# EAGLE design led_jetracer_matrix (EAGLE 9.6.2)

## Sheet 1 of 2
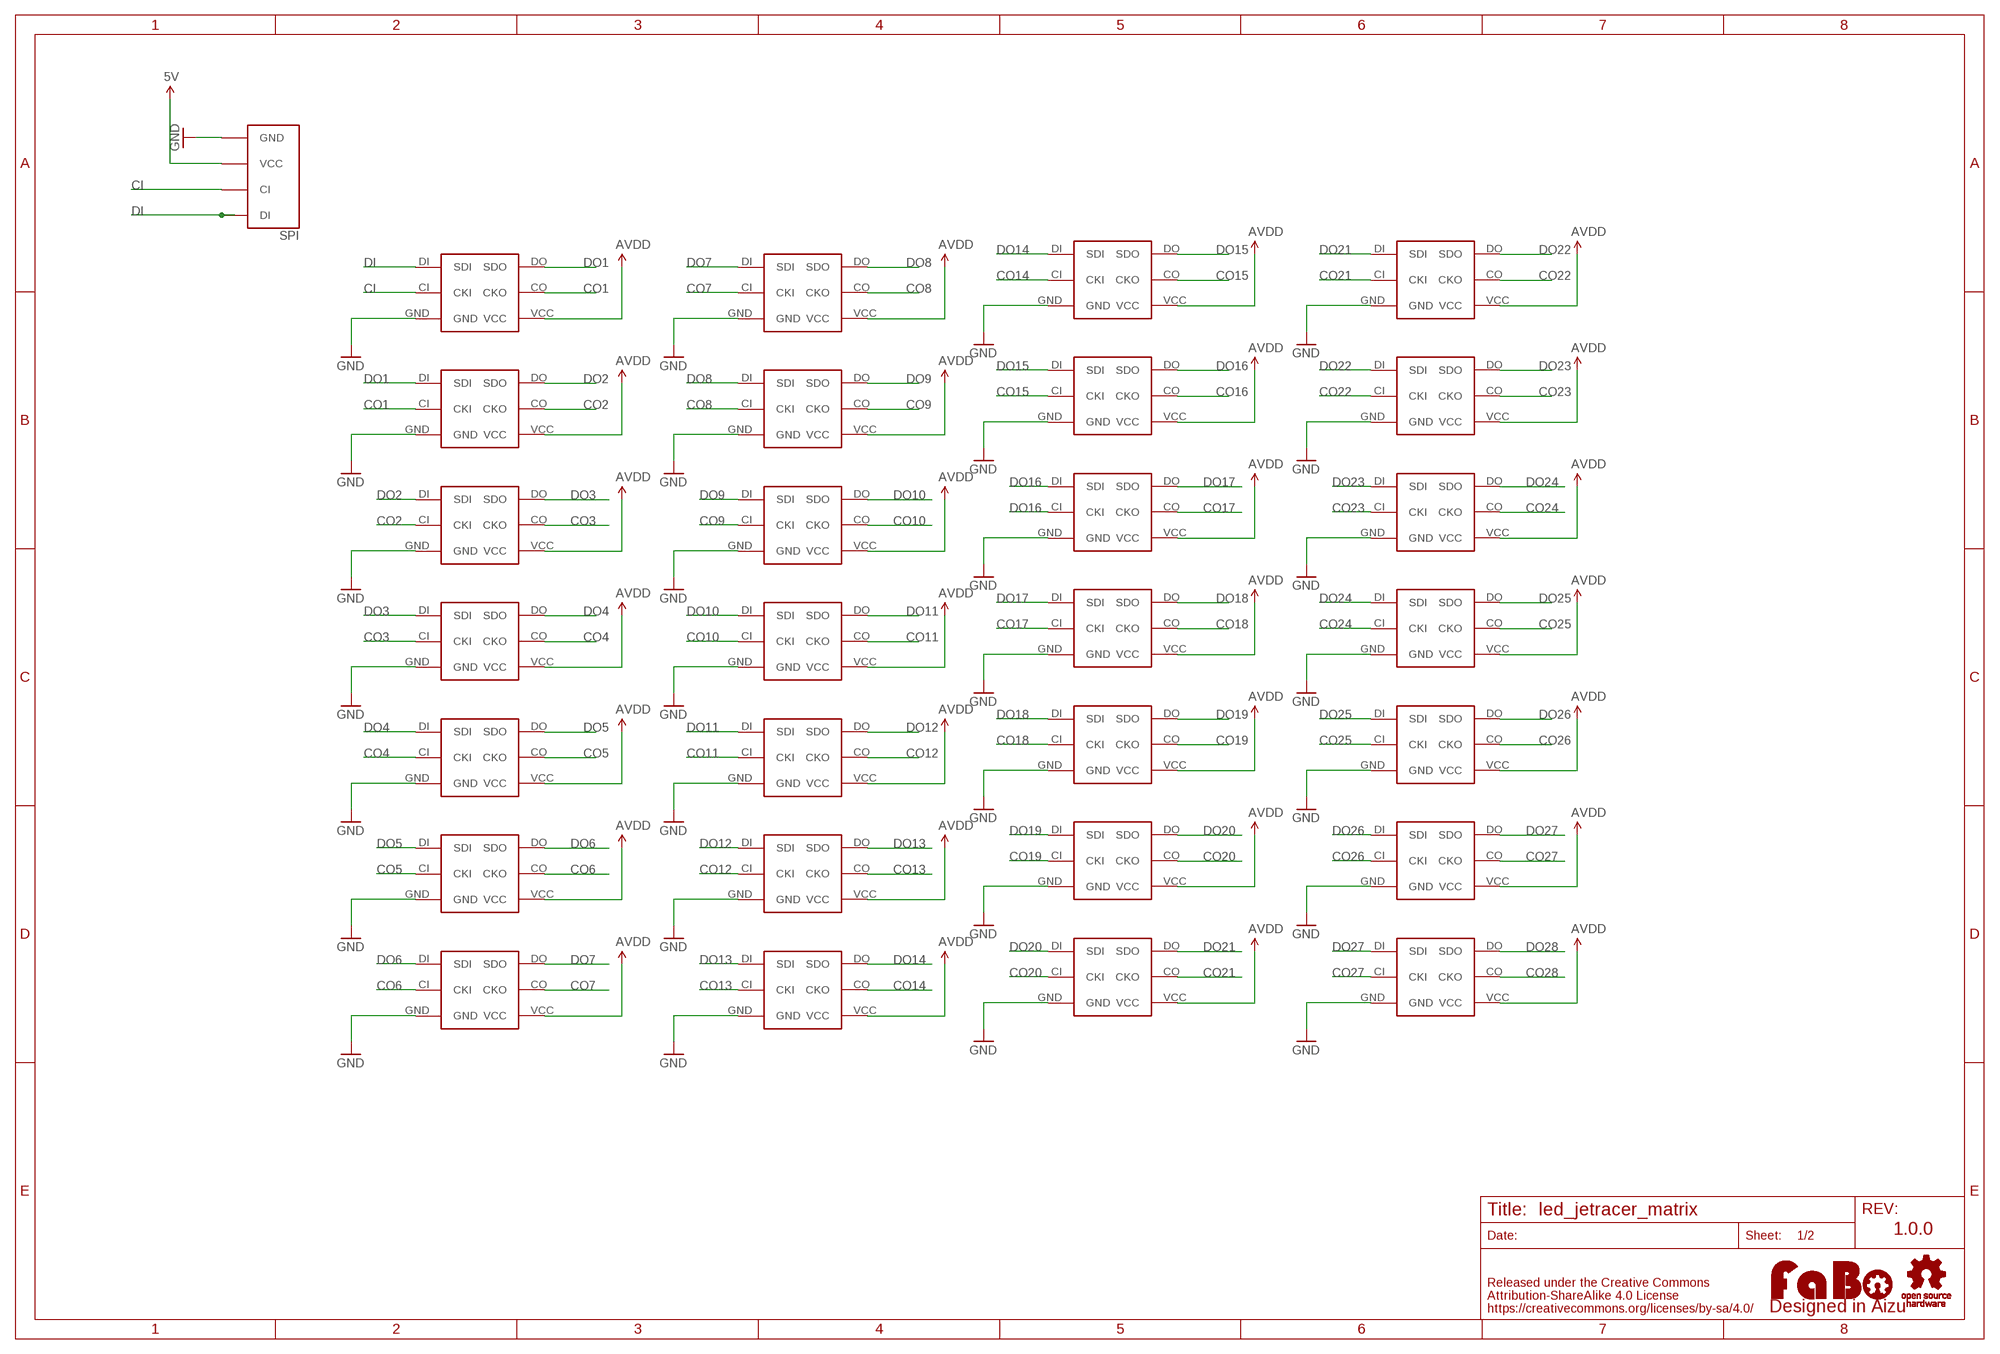
[diagram p0: schematic, sheet 1]

### Parts
0  APA102_IPIXEL  [APA102(IPIXEL)]
1  APA102_IPIXEL  [APA102(IPIXEL)]
2  APA102_IPIXEL  [APA102(IPIXEL)]
3  APA102_IPIXEL  [APA102(IPIXEL)]
4  APA102_IPIXEL  [APA102(IPIXEL)]
5  APA102_IPIXEL  [APA102(IPIXEL)]
6  APA102_IPIXEL  [APA102(IPIXEL)]
7  APA102_IPIXEL  [APA102(IPIXEL)]
8  APA102_IPIXEL  [APA102(IPIXEL)]
9  APA102_IPIXEL  [APA102(IPIXEL)]
10  APA102_IPIXEL  [APA102(IPIXEL)]
11  APA102_IPIXEL  [APA102(IPIXEL)]
12  APA102_IPIXEL  [APA102(IPIXEL)]
13  APA102_IPIXEL  [APA102(IPIXEL)]
14  APA102_IPIXEL  [APA102(IPIXEL)]
15  APA102_IPIXEL  [APA102(IPIXEL)]
16  APA102_IPIXEL  [APA102(IPIXEL)]
17  APA102_IPIXEL  [APA102(IPIXEL)]
18  APA102_IPIXEL  [APA102(IPIXEL)]
19  APA102_IPIXEL  [APA102(IPIXEL)]
20  APA102_IPIXEL  [APA102(IPIXEL)]
21  APA102_IPIXEL  [APA102(IPIXEL)]
22  APA102_IPIXEL  [APA102(IPIXEL)]
23  APA102_IPIXEL  [APA102(IPIXEL)]
24  APA102_IPIXEL  [APA102(IPIXEL)]
25  APA102_IPIXEL  [APA102(IPIXEL)]
26  APA102_IPIXEL  [APA102(IPIXEL)]
27  APA102_IPIXEL  [APA102(IPIXEL)]
LOGO1  LOGO_FABO-M_BOTTOM  [LOGO_FABO_M_BOTTOM]
SPI  FABO-SPI-LED-B04B-BOTTOM  [SPI-B04-PASK-1-BOTTOM]
U$3  LOGO_OSHW-S_BOTTOM  [LOGO_OSHW_S_BOTTOM]

### Nets
5V: SPI.VCC
AVDD: 0.VCC 1.VCC 2.VCC 3.VCC 4.VCC 5.VCC 6.VCC 7.VCC 8.VCC 9.VCC 10.VCC 11.VCC 12.VCC 13.VCC 14.VCC 15.VCC 16.VCC 17.VCC 18.VCC 19.VCC 20.VCC 21.VCC 22.VCC 23.VCC 24.VCC 25.VCC 26.VCC 27.VCC ; also sheet 2
CI: 0.CI(CKI) SPI.CI
CO1: 0.CO(CKO) 1.CI(CKI)
CO2: 1.CO(CKO) 2.CI(CKI)
CO3: 2.CO(CKO) 3.CI(CKI)
CO4: 3.CO(CKO) 4.CI(CKI)
CO5: 4.CO(CKO) 5.CI(CKI)
CO6: 5.CO(CKO) 6.CI(CKI)
CO7: 6.CO(CKO) 7.CI(CKI)
CO8: 7.CO(CKO) 8.CI(CKI)
CO9: 8.CO(CKO) 9.CI(CKI)
CO10: 9.CO(CKO) 10.CI(CKI)
CO11: 10.CO(CKO) 11.CI(CKI)
CO12: 11.CO(CKO) 12.CI(CKI)
CO13: 12.CO(CKO) 13.CI(CKI)
CO14: 13.CO(CKO) 14.CI(CKI)
CO15: 14.CO(CKO) 15.CI(CKI)
CO16: 15.CO(CKO)
CO17: 16.CO(CKO) 17.CI(CKI)
CO18: 17.CO(CKO) 18.CI(CKI)
CO19: 18.CO(CKO) 19.CI(CKI)
CO20: 19.CO(CKO) 20.CI(CKI)
CO21: 20.CO(CKO) 21.CI(CKI)
CO22: 21.CO(CKO) 22.CI(CKI)
CO23: 22.CO(CKO) 23.CI(CKI)
CO24: 23.CO(CKO) 24.CI(CKI)
CO25: 24.CO(CKO) 25.CI(CKI)
CO26: 25.CO(CKO) 26.CI(CKI)
CO27: 26.CO(CKO) 27.CI(CKI)
CO28: 27.CO(CKO) ; also sheet 2
DI: 0.DI(SDI) SPI.DI
DO1: 0.DO(SDO) 1.DI(SDI)
DO2: 1.DO(SDO) 2.DI(SDI)
DO3: 2.DO(SDO) 3.DI(SDI)
DO4: 3.DO(SDO) 4.DI(SDI)
DO5: 4.DO(SDO) 5.DI(SDI)
DO6: 5.DO(SDO) 6.DI(SDI)
DO7: 6.DO(SDO) 7.DI(SDI)
DO8: 7.DO(SDO) 8.DI(SDI)
DO9: 8.DO(SDO) 9.DI(SDI)
DO10: 9.DO(SDO) 10.DI(SDI)
DO11: 10.DO(SDO) 11.DI(SDI)
DO12: 11.DO(SDO) 12.DI(SDI)
DO13: 12.DO(SDO) 13.DI(SDI)
DO14: 13.DO(SDO) 14.DI(SDI)
DO15: 14.DO(SDO) 15.DI(SDI)
DO16: 15.DO(SDO) 16.CI(CKI) 16.DI(SDI)
DO17: 16.DO(SDO) 17.DI(SDI)
DO18: 17.DO(SDO) 18.DI(SDI)
DO19: 18.DO(SDO) 19.DI(SDI)
DO20: 19.DO(SDO) 20.DI(SDI)
DO21: 20.DO(SDO) 21.DI(SDI)
DO22: 21.DO(SDO) 22.DI(SDI)
DO23: 22.DO(SDO) 23.DI(SDI)
DO24: 23.DO(SDO) 24.DI(SDI)
DO25: 24.DO(SDO) 25.DI(SDI)
DO26: 25.DO(SDO) 26.DI(SDI)
DO27: 26.DO(SDO) 27.DI(SDI)
DO28: 27.DO(SDO) ; also sheet 2
GND: 0.GND 1.GND 2.GND 3.GND 4.GND 5.GND 6.GND 7.GND 8.GND 9.GND 10.GND 11.GND 12.GND 13.GND 14.GND 15.GND 16.GND 17.GND 18.GND 19.GND 20.GND 21.GND 22.GND 23.GND 24.GND 25.GND 26.GND 27.GND SPI.GND ; also sheet 2

### Notes on the sheet
- 1.0.0

## Sheet 2 of 2
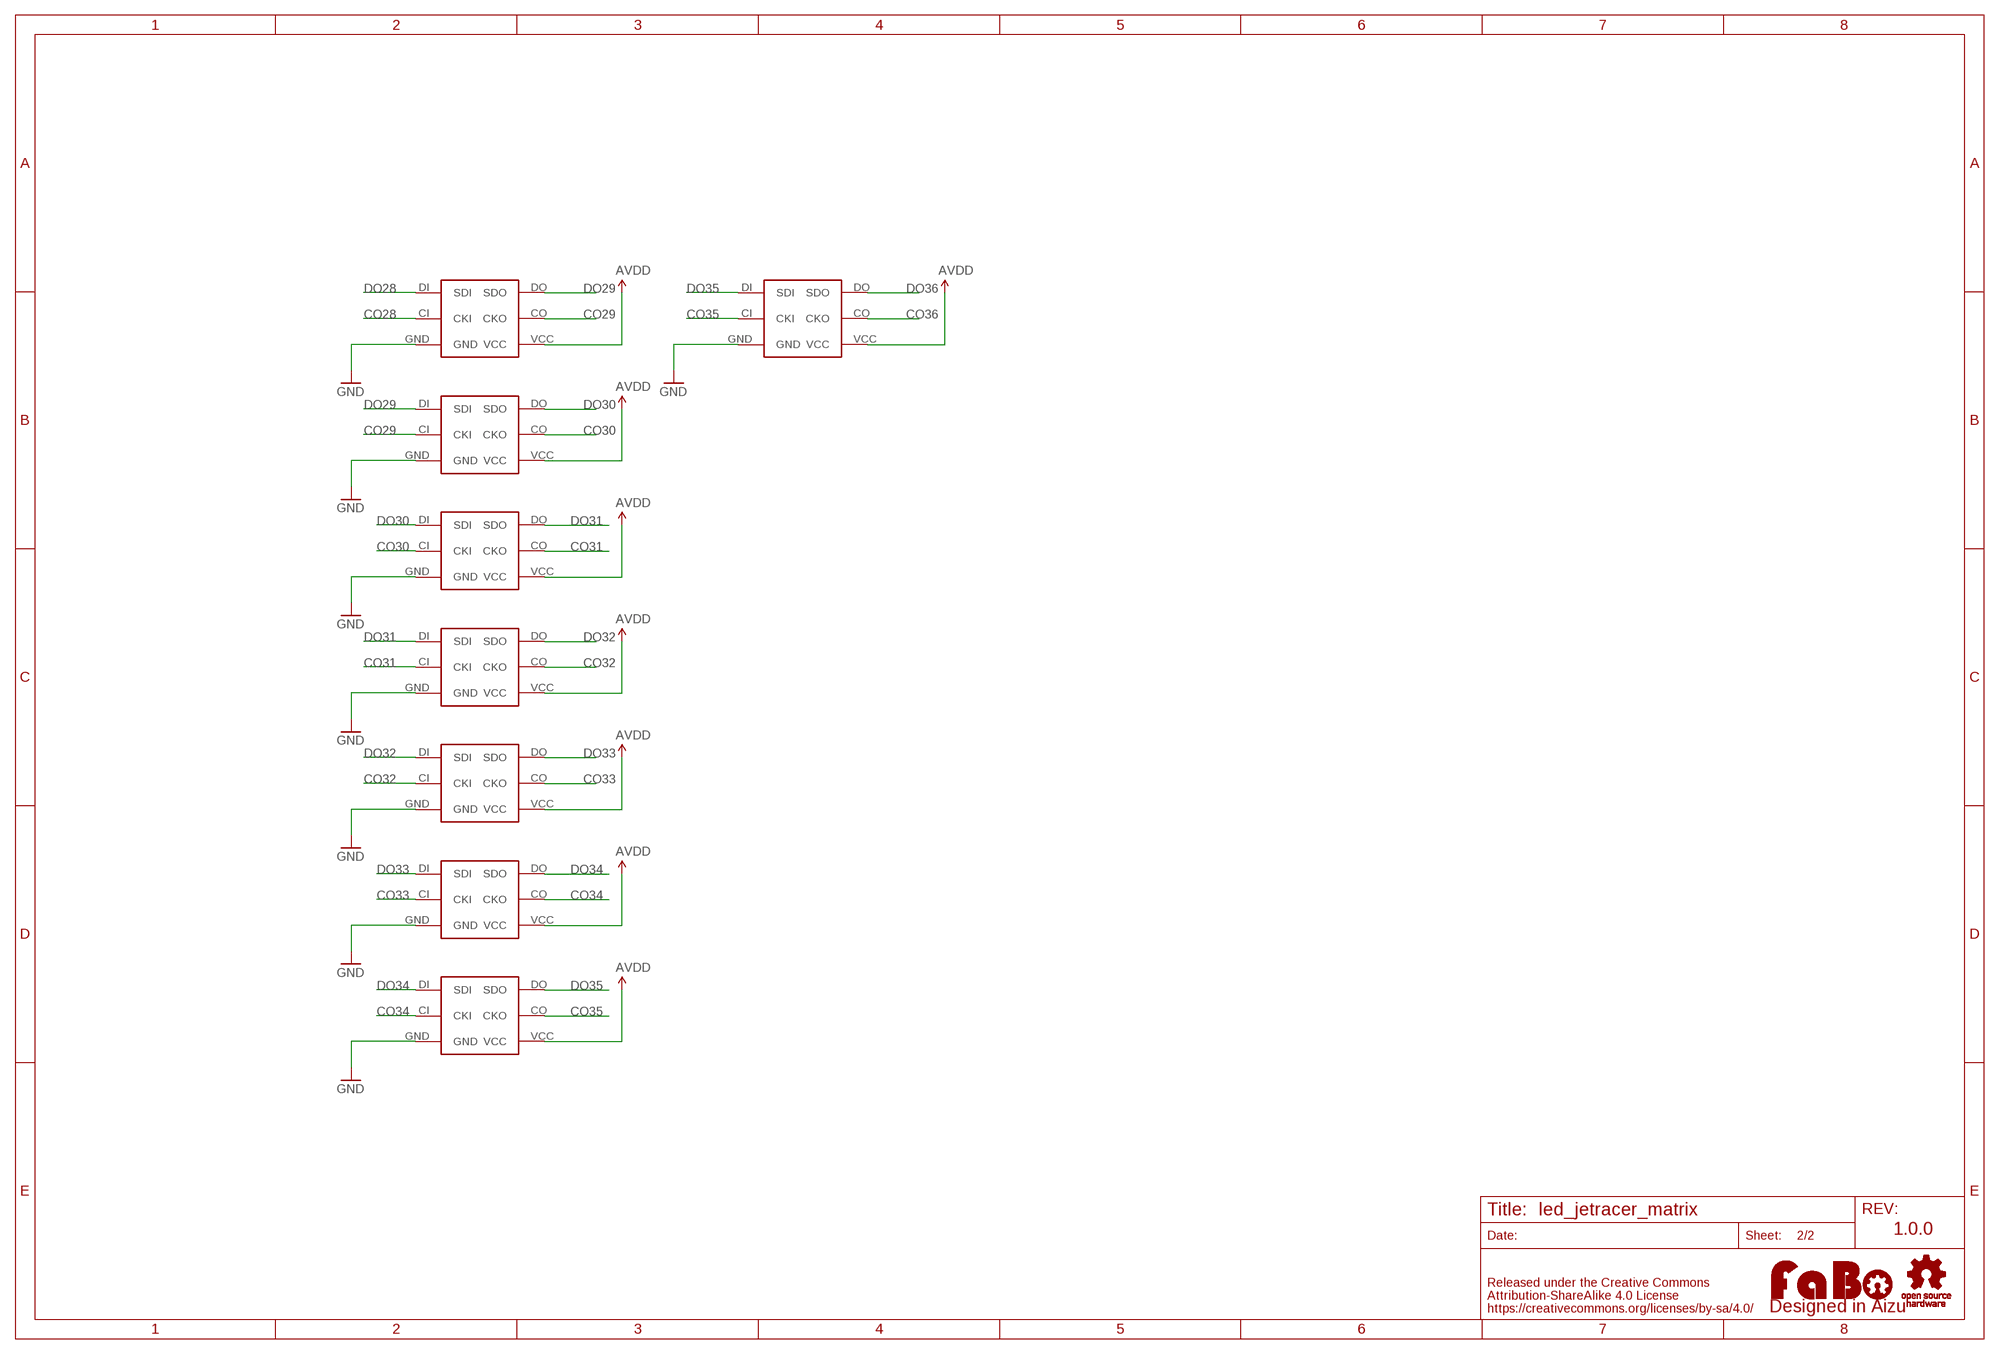
[diagram p1: schematic, sheet 2]

### Parts
28  APA102_IPIXEL  [APA102(IPIXEL)]
29  APA102_IPIXEL  [APA102(IPIXEL)]
30  APA102_IPIXEL  [APA102(IPIXEL)]
31  APA102_IPIXEL  [APA102(IPIXEL)]
32  APA102_IPIXEL  [APA102(IPIXEL)]
33  APA102_IPIXEL  [APA102(IPIXEL)]
34  APA102_IPIXEL  [APA102(IPIXEL)]
35  APA102_IPIXEL  [APA102(IPIXEL)]

### Nets
AVDD: 28.VCC 29.VCC 30.VCC 31.VCC 32.VCC 33.VCC 34.VCC 35.VCC ; also sheet 1
CO28: 28.CI(CKI) ; also sheet 1
CO29: 28.CO(CKO) 29.CI(CKI)
CO30: 29.CO(CKO) 30.CI(CKI)
CO31: 30.CO(CKO) 31.CI(CKI)
CO32: 31.CO(CKO) 32.CI(CKI)
CO33: 32.CO(CKO) 33.CI(CKI)
CO34: 33.CO(CKO) 34.CI(CKI)
CO35: 34.CO(CKO) 35.CI(CKI)
CO36: 35.CO(CKO)
DO28: 28.DI(SDI) ; also sheet 1
DO29: 28.DO(SDO) 29.DI(SDI)
DO30: 29.DO(SDO) 30.DI(SDI)
DO31: 30.DO(SDO) 31.DI(SDI)
DO32: 31.DO(SDO) 32.DI(SDI)
DO33: 32.DO(SDO) 33.DI(SDI)
DO34: 33.DO(SDO) 34.DI(SDI)
DO35: 34.DO(SDO) 35.DI(SDI)
DO36: 35.DO(SDO)
GND: 28.GND 29.GND 30.GND 31.GND 32.GND 33.GND 34.GND 35.GND ; also sheet 1

### Notes on the sheet
- 1.0.0

## Library data of the parts
0 1-35 = FaBo-LED:APA102
LOGO1 = component:LOGO_FABO
SPI = FaBo-Connetor:FABO-SPI-LED
U$3 = component:LOGO_OSHW

## Net classes
2 gnd: width 0.254 mm, drill 0.61 mm, clearance 0.254 mm
3 usbvcc: width 0.254 mm, drill 0.61 mm, clearance 0.254 mm
4 aref: width 0.254 mm, drill 0.61 mm, clearance 0.254 mm

## Board
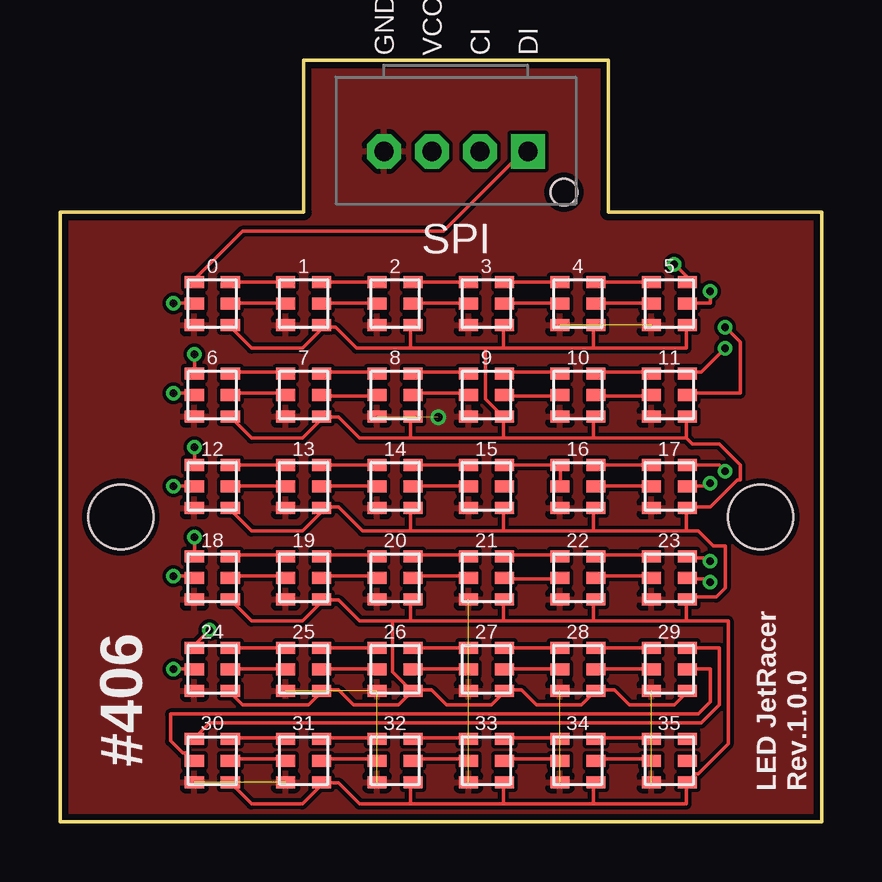
[diagram p2: board, top side]
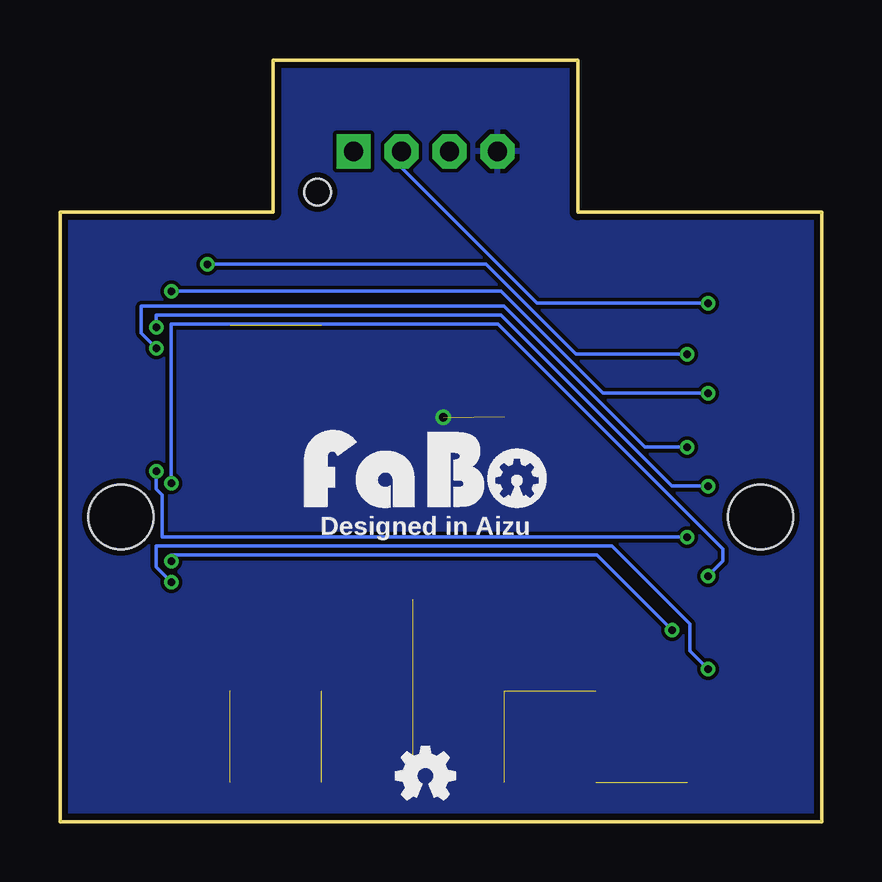
[diagram p3: board, bottom side, seen from below]

Size 31.75 x 31.75 mm. Coordinates in mm from the lower left corner, seen from the top.
Outline: 0,25.4 10.16,25.4 10.16,31.75 22.86,31.75 22.86,25.4 31.75,25.4 31.75,0 0,0 0,25.4
Copper layers (1*16): Top 0.035mm / dielectric 1.6mm / Bottom 0.035mm
Design rules "PCBway": minimum track width 6mil, minimum drill 12mil, track to track 6mil, track to pad 6mil, pad to pad 6mil, via to via 6mil, smd to smd 6mil, copper to edge 10mil, drill to drill 10mil, minimum pad ring 10mil, minimum via ring 6mil, stop-mask expansion 2mil, vias tented up to drill 100mil, thermal gap 8mil
Holes 2.7 mm at 2.54,12.7 29.21,12.7

### Footprints (pad centres in the part's own frame; a part is rotated, then mirrored left to right if it is on the bottom)
APA102(IPIXEL) = smd 0.8 x 0.5: CI -0.75,0; CO 0.75,0; DI -0.75,0.9; DO 0.75,0.9; GND -0.75,-0.9; VCC 0.75,-0.9
SPI-B04-PASK-1-BOTTOM = drill 0.8 pad 1.422 octagon: CI -1,0; GND 3,0; VCC 1,0 | drill 0.8 pad 1.422 square: DI -3,0 | hole 1.1: -4.5,1.7

### Placement (x,y rotation side)
0  6.35,21.59 0 top
1  10.16,21.59 0 top
2  13.97,21.59 0 top
3  17.78,21.59 0 top
4  21.59,21.59 0 top
5  25.4,21.59 0 top
6  6.35,17.78 0 top
7  10.16,17.78 0 top
8  13.97,17.78 0 top
9  17.78,17.78 0 top
10  21.59,17.78 0 top
11  25.4,17.78 0 top
12  6.35,13.97 0 top
13  10.16,13.97 0 top
14  13.97,13.97 0 top
15  17.78,13.97 0 top
16  21.59,13.97 0 top
17  25.4,13.97 0 top
18  6.35,10.16 0 top
19  10.16,10.16 0 top
20  13.97,10.16 0 top
21  17.78,10.16 0 top
22  21.59,10.16 0 top
23  25.4,10.16 0 top
24  6.35,6.35 0 top
25  10.16,6.35 0 top
26  13.97,6.35 0 top
27  17.78,6.35 0 top
28  21.59,6.35 0 top
29  25.4,6.35 0 top
30  6.35,2.54 0 top
31  10.16,2.54 0 top
32  13.97,2.54 0 top
33  17.78,2.54 0 top
34  21.59,2.54 0 top
35  25.4,2.54 0 top
LOGO1  16.51,12.7 0 top
SPI  16.51,27.94 180 top
U$3  16.51,1.9 0 top

### Tracks (layer width: path | path; a pad name or v marks a point on that pad's centre or on a via)
AVDD
  Top 0.152: 10.98,1.6 10.11,0.73 7.98,0.73 7.11,1.6 30.VCC | 14.61,0.73 14.61,1.6 32.VCC | 14.61,0.73 12.48,0.73 11.61,1.6 10.98,1.6 | 10.98,1.6 31.VCC | 18.48,0.73 18.48,1.6 33.VCC | 14.61,0.73 18.48,0.73 | 22.23,0.73 22.23,1.6 34.VCC | 18.48,0.73 22.23,0.73 | 22.23,0.73 26.11,0.73 26.11,1.6 35.VCC 26.23,1.73 26.48,1.98 26.61,1.98 27.86,3.23 27.86,8.36 26.11,8.36 | 24.VCC 7.11,5.36 7.61,4.86 10.36,4.86 10.86,5.36 25.VCC 10.98,5.48 11.61,5.48 12.23,4.86 14.11,4.86 14.61,5.36 26.VCC | 26.VCC 14.73,5.48 15.48,5.48 16.11,4.86 17.98,4.86 18.48,5.36 27.VCC 18.61,5.48 19.23,5.48 19.86,4.86 21.73,4.86 22.23,5.36 28.VCC 22.36,5.48 23.11,5.48 23.73,4.86 25.61,4.86 26.11,5.36 29.VCC | 10.98,9.23 10.11,8.36 7.98,8.36 7.11,9.23 18.VCC | 14.61,8.36 14.61,9.23 20.VCC | 13.86,8.36 12.48,8.36 11.61,9.23 10.98,9.23 | 13.86,8.36 14.61,8.36 | 10.98,9.23 19.VCC | 18.48,8.36 18.48,9.23 21.VCC | 14.61,8.36 18.48,8.36 | 22.23,8.36 22.23,9.23 22.VCC | 18.48,8.36 22.23,8.36 | 26.11,8.36 26.11,9.23 23.VCC 26.23,9.36 27.36,9.36 27.73,9.73 27.73,11.48 27.23,11.48 26.61,12.11 26.11,12.11 | 22.23,8.36 26.11,8.36 | 13.86,8.36 13.86,6.23 14.61,5.48 26.VCC | 10.98,20.61 10.11,19.73 7.98,19.73 7.11,20.61 0.VCC | 14.61,19.73 14.61,20.61 2.VCC | 14.61,19.73 12.36,19.73 11.48,20.61 10.98,20.61 | 10.98,20.61 1.VCC | 18.48,19.73 18.48,20.61 3.VCC | 14.61,19.73 17.73,19.73 | 17.73,19.73 18.48,19.73 | 22.23,19.73 22.23,20.61 4.VCC | 18.48,19.73 22.23,19.73 | 22.23,19.73 26.11,19.73 26.11,20.61 5.VCC | 10.98,16.86 10.11,15.98 7.98,15.98 7.11,16.86 6.VCC | 14.61,15.98 14.61,16.86 8.VCC | 14.61,15.98 12.48,15.98 11.61,16.86 10.98,16.86
  Top 0.152: 10.98,16.86 7.VCC | 18.48,15.98 18.48,16.86 9.VCC 18.48,16.98 18.36,16.98 17.73,17.61 17.73,19.73 | 14.61,15.98 18.48,15.98 | 22.23,15.98 22.23,16.86 10.VCC | 18.48,15.98 22.23,15.98 | 26.11,15.98 26.11,16.86 11.VCC | 22.23,15.98 26.11,15.98 | 12.VCC 7.11,12.98 7.98,12.11 10.11,12.11 10.98,12.98 13.VCC 10.98,13.11 11.61,13.11 12.61,12.11 14.61,12.11 | 14.61,12.11 14.61,12.98 14.VCC | 18.48,12.11 18.48,12.98 15.VCC | 14.61,12.11 18.48,12.11 | 22.23,12.11 22.23,12.98 16.VCC | 18.48,12.11 22.23,12.11 | 26.11,12.11 26.11,12.98 17.VCC 26.23,13.11 27.11,13.11 28.23,14.23 28.36,14.23 28.36,14.86 27.48,15.73 26.36,15.73 26.11,15.98 | 22.23,12.11 26.11,12.11
CI  (via drill 0.3)
  Top 0.152: v4.73,21.61 5.48,21.61 0.CI
  Bottom 0.152: v4.73,21.61 11.86,21.61 17.48,27.23 17.48,27.86 SPI.CI
CO1
  Top 0.152: 0.CO 7.11,21.61 9.36,21.61 1.CI
CO2
  Top 0.152: 1.CO 10.98,21.61 13.11,21.61 2.CI
CO3
  Top 0.152: 2.CO 14.73,21.61 16.98,21.61 3.CI
CO4
  Top 0.152: 3.CO 18.61,21.61 20.73,21.61 4.CI
CO5
  Top 0.152: 4.CO 22.36,21.61 24.61,21.61 5.CI
CO6  (via drill 0.3)
  Top 0.152: v4.73,17.86 5.48,17.86 6.CI | v27.11,22.11 27.11,21.61 26.23,21.61 5.CO
  Bottom 0.152: v4.73,17.86 9.11,17.86 13.36,22.11 v27.11,22.11
CO7
  Top 0.152: 6.CO 7.11,17.86 9.36,17.86 7.CI
CO8
  Top 0.152: 7.CO 10.98,17.73 13.11,17.73 8.CI
CO9
  Top 0.152: 8.CO 14.73,17.86 16.98,17.86 9.CI
CO10
  Top 0.152: 9.CO 18.61,17.73 20.73,17.73 10.CI
CO11
  Top 0.152: 10.CO 22.36,17.73 24.61,17.73 11.CI
CO12  (via drill 0.3)
  Top 0.152: v4.73,13.98 5.48,13.98 12.CI | v27.73,20.61 28.36,19.98 28.36,17.86 26.23,17.86 11.CO
  Bottom 0.152: v4.73,13.98 6.23,13.98 13.36,21.11 27.73,21.11 v27.73,20.61
CO13
  Top 0.152: 12.CO 9.36,13.98 13.CI
CO14
  Top 0.152: 13.CO 10.98,13.98 13.11,13.98 14.CI
CO15
  Top 0.152: 14.CO 16.98,13.98 15.CI
CO17
  Top 0.152: 16.CO 22.36,13.98 24.61,13.98 17.CI
CO18  (via drill 0.3)
  Top 0.152: v4.73,10.23 5.48,10.23 18.CI | v27.11,14.11 26.98,13.98 26.23,13.98 17.CO
  Bottom 0.152: v4.73,10.23 4.11,10.86 4.11,11.36 13.48,20.73 27.11,20.73 v27.11,14.11
CO19
  Top 0.152: 18.CO 7.11,10.23 9.36,10.23 19.CI
CO20
  Top 0.152: 19.CO 10.98,10.23 13.11,10.23 20.CI
CO21
  Top 0.152: 20.CO 14.73,10.23 16.98,10.23 21.CI
CO22
  Top 0.152: 21.CO 18.61,10.11 20.73,10.11 22.CI
CO23
  Top 0.152: 22.CO 22.36,10.23 24.61,10.23 23.CI
CO24  (via drill 0.3)
  Top 0.152: v4.73,6.36 5.48,6.36 24.CI | v27.11,9.98 26.98,10.11 26.23,10.11 23.CO
  Bottom 0.152: v4.73,6.36 5.48,7.11 5.48,8.23 8.73,11.48 27.73,11.48 27.73,10.61 v27.11,9.98
CO25
  Top 0.152: 24.CO 9.36,6.36 25.CI
CO26
  Top 0.152: 25.CO 10.98,6.36 13.11,6.36 26.CI
CO27
  Top 0.152: 26.CO 16.98,6.36 27.CI
CO28
  Top 0.152: 27.CO 18.61,6.36 20.73,6.36 28.CI
CO29
  Top 0.152: 28.CO 22.36,6.36 24.61,6.36 29.CI
CO30
  Top 0.152: 30.CI 5.48,2.6 5.23,2.85 5.11,2.85 4.61,3.35 4.61,4.48 26.61,4.48 27.11,4.98 27.11,6.36 26.23,6.36 29.CO
CO31
  Top 0.152: 30.CO 7.11,2.6 9.36,2.6 31.CI
CO32
  Top 0.152: 31.CO 10.98,2.6 13.11,2.6 32.CI
CO33
  Top 0.152: 32.CO 14.73,2.6 16.98,2.6 33.CI
CO34
  Top 0.152: 33.CO 18.61,2.6 20.73,2.6 34.CI
CO35
  Top 0.152: 34.CO 22.36,2.6 24.61,2.6 35.CI
DI
  Top 0.152: 0.DI 5.61,22.61 7.61,24.61 15.98,24.61 19.23,27.86 19.48,27.86 SPI.DI
DO1
  Top 0.152: 0.DO 9.36,22.48 1.DI
DO2
  Top 0.152: 1.DO 10.98,22.48 13.11,22.48 2.DI
DO3
  Top 0.152: 2.DO 16.98,22.48 3.DI
DO4
  Top 0.152: 3.DO 18.61,22.48 20.73,22.48 4.DI
DO5
  Top 0.152: 4.DO 22.36,22.48 24.61,22.48 5.DI
DO6  (via drill 0.3)
  Top 0.152: v5.61,19.48 5.61,18.73 6.DI | v25.61,23.23 26.23,22.61 5.DO
  Bottom 0.152: v5.61,19.48 10.23,19.48 13.98,23.23 v25.61,23.23
DO7
  Top 0.152: 6.DO 7.11,18.73 9.36,18.73 7.DI
DO8
  Top 0.152: 7.DO 10.98,18.73 13.11,18.73 8.DI
DO9
  Top 0.152: 8.DO 14.73,18.73 16.98,18.73 9.DI
DO10
  Top 0.152: 9.DO 18.61,18.73 20.73,18.73 10.DI
DO11
  Top 0.152: 10.DO 22.36,18.73 24.61,18.73 11.DI
DO12  (via drill 0.3)
  Top 0.152: v5.61,15.61 5.61,14.98 12.DI | v27.73,19.73 26.73,18.73 26.23,18.73 11.DO
  Bottom 0.152: v5.61,15.61 7.36,15.61 13.23,21.48 28.36,21.48 28.36,20.36 v27.73,19.73
DO13
  Top 0.152: 12.DO 7.11,14.86 9.36,14.86 13.DI
DO14
  Top 0.152: 13.DO 10.98,14.86 13.11,14.86 14.DI
DO15
  Top 0.152: 14.DO 14.73,14.86 16.98,14.86 15.DI
DO16
  Top 0.152: 15.DO 18.61,14.86 20.73,14.86 16.DI 20.86,14.86 20.86,13.98 16.CI
DO17
  Top 0.152: 16.DO 22.36,14.86 24.61,14.86 17.DI
DO18  (via drill 0.3)
  Top 0.152: v5.61,11.86 5.61,11.11 18.DI | v27.73,14.61 27.48,14.86 26.23,14.86 17.DO
  Bottom 0.152: v5.61,11.86 27.48,11.86 27.48,13.61 27.73,13.86 v27.73,14.61
DO19
  Top 0.152: 18.DO 7.11,11.11 9.36,11.11 19.DI
DO20
  Top 0.152: 19.DO 10.98,11.11 13.11,11.11 20.DI
DO21
  Top 0.152: 20.DO 14.73,11.11 16.98,11.11 21.DI
DO22
  Top 0.152: 21.DO 18.61,11.11 20.73,11.11 22.DI
DO23
  Top 0.152: 22.DO 22.36,11.11 24.61,11.11 23.DI
DO24  (via drill 0.3)
  Top 0.152: v6.23,7.98 5.61,7.36 24.DI | v27.11,10.86 26.98,10.98 26.23,10.98 23.DO
  Bottom 0.152: v6.23,7.98 9.36,11.11 27.11,11.11 v27.11,10.86
DO25
  Top 0.152: 24.DO 7.11,7.23 9.36,7.23 25.DI
DO26
  Top 0.152: 25.DO 10.98,7.23 13.11,7.23 26.DI
DO27
  Top 0.152: 26.DO 14.73,7.23 16.98,7.23 27.DI
DO28
  Top 0.152: 27.DO 18.61,7.23 20.73,7.23 28.DI
DO29
  Top 0.152: 28.DO 22.36,7.23 24.61,7.23 29.DI
DO30
  Top 0.152: 30.DI 5.61,3.48 6.23,4.11 26.73,4.11 27.48,4.86 27.48,7.23 26.23,7.23 29.DO
DO31
  Top 0.152: 30.DO 7.11,3.48 9.36,3.48 31.DI
DO32
  Top 0.152: 31.DO 10.98,3.48 13.11,3.48 32.DI
DO33
  Top 0.152: 32.DO 14.73,3.48 16.98,3.48 33.DI
DO34
  Top 0.152: 33.DO 18.61,3.48 20.73,3.48 34.DI
DO35
  Top 0.152: 34.DO 22.36,3.48 24.61,3.48 35.DI
GND  (via drill 0.35)  (9 unrouted)
  other vias: 15.77,16.85
  pour Top: -1.27,-1.27 -1.27,32.38 34.29,32.38 34.29,-1.27
  pour Top: -1.27,-1.27 33.02,-1.27 33.02,33.02 -1.27,33.02
  pour Bottom: -1.27,-1.27 33.02,-1.27 33.02,31.75 -1.27,31.75

### Text on the board
tPlace: #406 | LED JetRacer | Rev.1.0.0
bPlace: Designed in Aizu